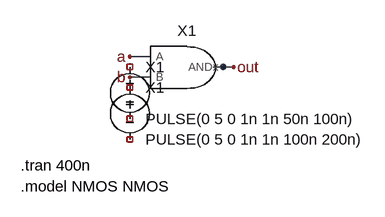
[diagram p0: schematic ANDX_TEST.asc]
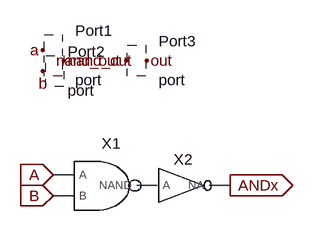
[diagram p1: sub-circuit andx.asc]
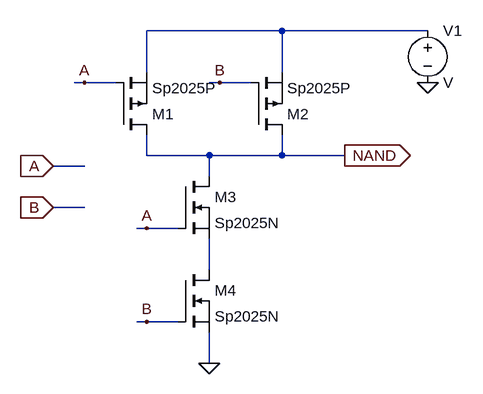
[diagram p2: sub-circuit nand.asc]
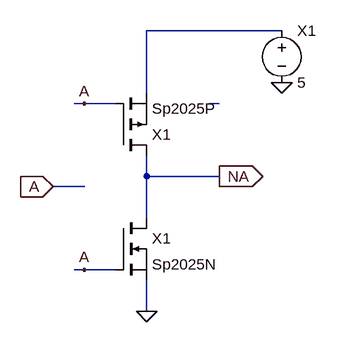
[diagram p3: sub-circuit invert.asc]
ANDX_TEST.asc, the LTspice schematic file:
Version 4
.include "ModelSp2025.txt"
.include "NAND.asc"
.include "INVERT.asc"
SHEET 1 880 680
WIRE 176 128 144 128
WIRE 176 160 144 160
WIRE 304 144 272 144

FLAG 304 144 out
FLAG 144 128 a
FLAG 144 160 b
SYMBOL ANDX 224 144 R0
SYMATTR InstName X1
SYMBOL VOLTAGE 144 128 R0
WINDOW 123 0 0 Left 0
WINDOW 39 0 0 Left 0
SYMATTR InstName X1
SYMATTR Value PULSE(0 5 0 1n 1n 50n 100n)
SYMBOL VOLTAGE 144 160 R0
WINDOW 123 0 0 Left 0
WINDOW 39 0 0 Left 0
SYMATTR InstName X1
SYMATTR Value PULSE(0 5 0 1n 1n 100n 200n)
TEXT -24 296 Left 2 !.tran 400n
TEXT -24 328 Left 2 !.model NMOS NMOS

andx.asc, the sub-circuit schematic file:
Version 4
SHEET 1 880 680
.lib 
.include "NAND.asc"
.include "INVERT.asc"
WIRE 80 112 48 112
WIRE 208 128 176 128
WIRE 320 128 288 128
WIRE 80 144 48 144
FLAG 48 112 A
IOPIN 48 112 In
FLAG 48 144 B
IOPIN 48 144 In
FLAG 320 128 ANDx
IOPIN 320 128 Out
SYMBOL NAND 128 128 R0
SYMATTR InstName X1
SYMBOL INVERT 240 128 R0
SYMATTR InstName X2
FLAG 32 -80 a
FLAG 32 -48 b
FLAG 64 -64 nand_out
FLAG 192 -64 out
FLAG 160 -64 nand_out
SYMBOL port 32 -80 R0
SYMATTR InstName Port1
SYMATTR SpiceModel input
SYMBOL port 32 -48 R0
SYMATTR InstName Port2
SYMATTR SpiceModel input
SYMBOL port 192 -64 R0
SYMATTR InstName Port3

nand.asc, the sub-circuit schematic file:
Version 4
SHEET 1 880 680
.lib SHEET 1 880 680
WIRE 336 -160 128 -160
WIRE 560 -160 336 -160
WIRE 128 -96 128 -160
WIRE 336 -96 336 -160
WIRE 32 -80 16 -80
WIRE 80 -80 32 -80
WIRE 240 -80 224 -80
WIRE 288 -80 240 -80
WIRE 128 32 128 0
WIRE 224 32 128 32
WIRE 336 32 336 0
WIRE 336 32 224 32
WIRE 432 32 336 32
WIRE 32 48 -16 48
WIRE 224 64 224 32
WIRE 32 112 -16 112
WIRE 128 144 112 144
WIRE 176 144 128 144
WIRE 224 208 224 160
WIRE 128 288 112 288
WIRE 176 288 128 288
WIRE 224 352 224 304
FLAG 224 352 0
FLAG -16 48 A
IOPIN -16 48 In
FLAG -16 112 B
IOPIN -16 112 In
FLAG 128 144 A
FLAG 128 288 B
FLAG 32 -80 A
FLAG 240 -80 B
FLAG 432 32 NAND
IOPIN 432 32 Out
FLAG 560 -80 0
SYMBOL pmos 80 0 M180
SYMATTR InstName M1
SYMATTR Value Sp2025P
SYMBOL pmos 288 0 M180
SYMATTR InstName M2
SYMATTR Value Sp2025P
SYMBOL nmos 176 64 R0
SYMATTR InstName M3
SYMATTR Value Sp2025N
SYMBOL nmos 176 208 R0
SYMATTR InstName M4
SYMATTR Value Sp2025N
SYMBOL voltage 560 -176 R0
SYMATTR InstName V1

invert.asc, the sub-circuit schematic file:
Version 4
SHEET 1 880 680
WIRE 352 -80 144 -80
WIRE 144 16 144 -80
WIRE 48 32 32 32
WIRE 96 32 48 32
WIRE 256 32 240 32
WIRE 144 144 144 112
WIRE 256 144 144 144
WIRE 48 160 0 160
WIRE 144 208 144 144
WIRE 48 288 32 288
WIRE 96 288 48 288
WIRE 144 352 144 304
FLAG 144 352 0
FLAG 0 160 A
IOPIN 0 160 In
FLAG 48 288 A
FLAG 48 32 A
FLAG 256 144 NA
IOPIN 256 144 Out
FLAG 352 0 0
SYMBOL pmos 96 112 M180
SYMATTR InstName X1
SYMATTR Value Sp2025P
SYMBOL nmos 96 208 R0
SYMATTR InstName X1
SYMATTR Value Sp2025N
SYMBOL voltage 352 -96 R0
SYMATTR InstName X1
SYMATTR Value 5

The netlist it stands for:
* ANDX_TEST.asc
XX1 a b out andx
V§X1 NC_01 NC_02 PULSE(0 5 0 1n 1n 50n 100n)
V§X1 NC_03 NC_04 PULSE(0 5 0 1n 1n 100n 200n)

* block symbol definitions
.subckt andx A B ANDx
XX1 A B N001 nand
XX2 N001 ANDx invert
* Port1: input (symbol port not available, pin order unknown); nets seen at it: A, nand_out
* Port2: input (symbol port not available, pin order unknown); nets seen at it: B
* Port3: port (symbol port not available, pin order unknown); nets seen at it: nand_out, out
.ends andx

.subckt nand A B NAND
M1 NAND A N001 N001 Sp2025P
M2 NAND B N001 N001 Sp2025P
M3 NAND A N002 N002 Sp2025N
M4 N002 B 0 0 Sp2025N
V1 N001 0 V
.ends nand

.subckt invert A NA
M§X1 NA A N001 N001 Sp2025P
M§X1 NA A 0 0 Sp2025N
V§X1 N001 0 5
.ends invert

.model NMOS NMOS
.model PMOS PMOS
.lib standard.mos
.tran 400n
.model NMOS NMOS
.backanno
.end